# Altium schematic sheet 5V0 Buck Converter.SchDoc: LM27403 5.0V Buck Converter
size Letter; SheetNumber: 5; SheetTotal: 18
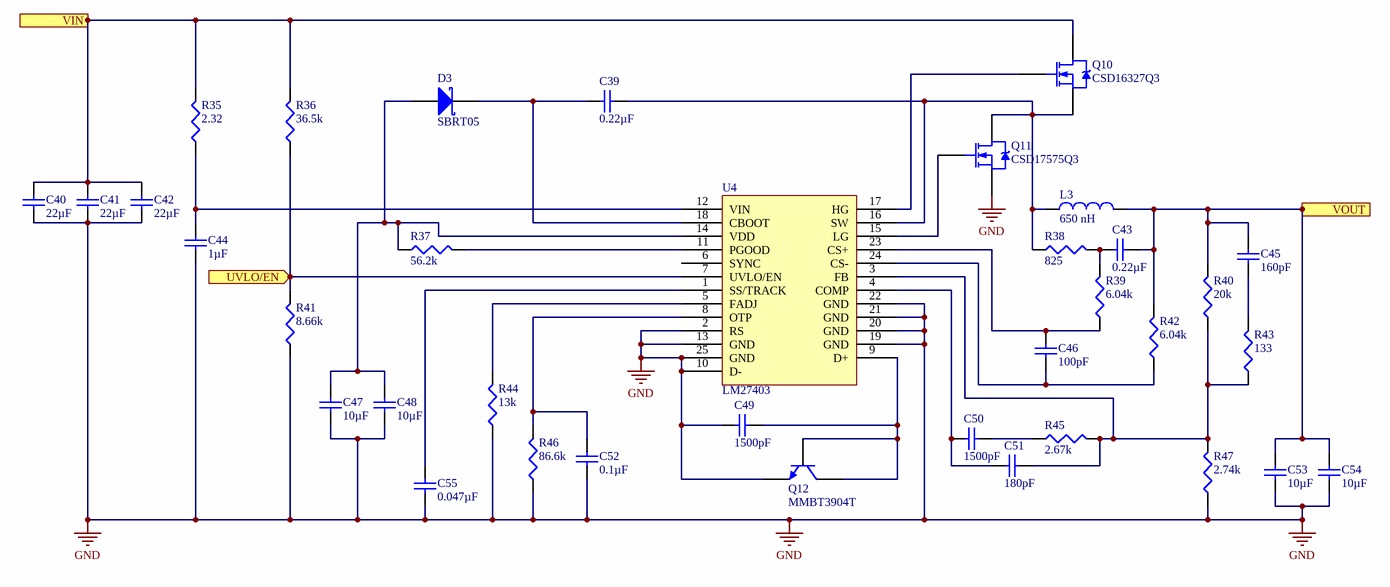
[diagram p0: 5V0 Buck Converter.SchDoc]

## Parts
C39  value 0.22µF  [TY-0402V]  (hidden comment: Cap)
C40  value 22µF  [TY-1210M]  (hidden comment: Cap)
C41  value 22µF  [TY-1210M]  (hidden comment: Cap)
C42  value 22µF  [TY-1210M]  (hidden comment: Cap)
C43  value 0.22µF  [TY-0402V]  (hidden comment: Cap)
C44  value 1µF  [TY-0402V]  (hidden comment: Cap)
C45  value 160pF  [KEM-CBR04]  (hidden comment: Cap)
C46  value 100pF  [TDK-CGA2B]  (hidden comment: Cap)
C47  value 10µF  [TY-0603A]  (hidden comment: Cap)
C48  value 10µF  [TY-0603A]  (hidden comment: Cap)
C49  value 1500pF  [TDK-CGA2B]  (hidden comment: Cap)
C50  value 1500pF  [TDK-CGA2B]  (hidden comment: Cap)
C51  value 180pF  [TDK-CGA2B]  (hidden comment: Cap)
C52  value 0.1µF  [TDK-CGA2B]  (hidden comment: Cap)
C53  value 10µF  [TY-1210M]  (hidden comment: Cap)
C54  value 10µF  [TY-1210M]  (hidden comment: Cap)
C55  value 0.047µF  [TDK-CGA2B]  (hidden comment: Cap)
D3  SBRT05  [DIOD-X2-DFN1006-2]
L3  value 650 nH  [CCI-XAL7070]  (hidden comment: XAL7070-651MEC)
Q10  CSD16327Q3  [TI-Q3]
Q11  CSD17575Q3  [TI-Q3]
Q12  MMBT3904T  [SOT523]
R35  value 2.32  [VSH-0402MCS]  (hidden comment: Res3)
R36  value 36.5k  [PANA-ERA2A]  (hidden comment: Res3)
R37  value 56.2k  [PANA-ERA2A]  (hidden comment: Res3)
R38  value 825  [PANA-ERA2A]  (hidden comment: Res3)
R39  value 6.04k  [PANA-ERA2A]  (hidden comment: Res3)
R40  value 20k  [PANA-ERJ2R]  (hidden comment: Res3)
R41  value 8.66k  [PANA-ERA2A]  (hidden comment: Res3)
R42  value 6.04k  [PANA-ERA2A]  (hidden comment: Res3)
R43  value 133  [PANA-ERJ2R]  (hidden comment: Res3)
R44  value 13k  [PANA-ERA2A]  (hidden comment: Res3)
R45  value 2.67k  [PANA-ERJ2R]  (hidden comment: Res3)
R46  value 86.6k  [PANA-ERA2A]  (hidden comment: Res3)
R47  value 2.74k  [PANA-ERJ2R]  (hidden comment: Res3)
U4  LM27403  [TI-RTW0024A]

## Ports
UVLO/EN (in), VIN (in), VOUT (out)

## Nets
GND: C40.1 C41.1 C42.1 C44.1 C47.1 C48.1 C49.1 C52.1 C53.1 C54.1 C55.1 Q11.3(S) Q12.1(E) R41.1 R44.1 R46.1 R47.1 U4.2(RS) U4.10(D-) U4.13(GND) U4.19(GND) U4.20(GND) U4.21(GND) U4.22(GND) U4.25(GND)
UVLO/EN: R36.1 R41.2 U4.7(UVLO/EN) ; port UVLO/EN
VIN: C40.2 C41.2 C42.2 Q10.2(D) R35.2 R36.2 ; port VIN
VOUT: C43.2 C45.2 C53.2 C54.2 L3.2 R40.2 R42.2 ; port VOUT
NetC39_1: C39.1 D3.2(K) U4.18(CBOOT)
NetC39_2: C39.2 L3.1 Q10.3(S) Q11.2(D) R38.1 U4.16(SW)
NetC43_1: C43.1 R38.2 R39.2
NetC44_2: C44.2 R35.1 U4.12(VIN)
NetC45_1: C45.1 R43.2
NetC46_1: C46.1 R42.1 U4.24(CS-)
NetC46_2: C46.2 R39.1 U4.23(CS+)
NetC47_2: C47.2 C48.2 D3.1(A) R37.1 U4.14(VDD)
NetC49_2: C49.2 Q12.2(B) Q12.3(C) U4.9(D+)
NetC50_1: C50.1 C51.1 U4.4(COMP)
NetC50_2: C50.2 R45.1
NetC51_2: C51.2 R40.1 R43.1 R45.2 R47.2 U4.3(FB)
NetC52_2: C52.2 R46.2 U4.8(OTP)
NetC55_2: C55.2 U4.1(SS/TRACK)
NetQ10_1: Q10.1(G) U4.17(HG)
NetQ11_1: Q11.1(G) U4.15(LG)
NetR37_2: R37.2 U4.11(PGOOD)
NetR44_2: R44.2 U4.5(FADJ)

Not connected (* = marked no-connect by the designer): U4 6(SYNC)

## Notes on the sheet
- (the "License"); you may not use or redistribute this file except in compliance with the License. You
- This file and the information within it are licensed under the terms of the Apache License, Version 2.0
- Copyright
- Unless required by applicable law or agreed to in writing, content distributed under the License is
- distributed on an "AS IS" BASIS, WITHOUT WARRANTIES OR CONDITIONS OF ANY KIND,
- either express or implied. See the License for the specific language governing permissions and
- limitations under the License.
- may obtain a copy of the License at:
- http://www.apache.org/licenses/LICENSE-2.0
- Title
- Size:
- Date:
- Letter
- Number:
- Time:
- Revision:
- Sheet
- of
- University of Alberta
- Deptartment of Electrical
- and Computer Engineering
- Edmonton AB, Canada
- T6G 1H9
- File:

## Library data of the parts
C39 C43 = PC-TY-00301: CAP CER 0.22UF 50V X5R 0402; Manufacturer Part Number: UMK105BJ224KV-F; Index: 301; Designator: C?; Tolerance: ±10%; Published: 2016-03-13; LatestRevisionDate: 2016-03-13; LatestRevisionNote: ...; PackageReference: 0402 (1005 Metric); Publisher: AlbertaSat; PackageDescription: Chip Capacitor, 2-Leads, Body 1.00x0.50mm, IPC Low Density; Part Number: PC-TY-00301; Supplier Part Number 1: 587-3500-1-ND; Supplier 1: Digi-key; Supplier Link: http://www.digikey.ca/product-search/en?keywords=587-3500-1-ND; Voltage-Rated: 50V; Temperature Coefficient: X5R; Application: General Purpose
C40-C42 = PC-TY-00742: CAP CER 22UF 25V X7R 1210; Manufacturer Part Number: TMK325B7226MM-TR; Index: 742; Designator: C?; Tolerance: ±20%; Published: 2016-03-13; LatestRevisionDate: 2016-03-13; LatestRevisionNote: ...; PackageReference: 1210 (3225 Metric); Publisher: AlbertaSat; PackageDescription: Chip Capacitor, 2-Leads, Body 3.20x2.50mm, IPC Low Density; Part Number: PC-TY-00742; Supplier Part Number 1: 587-2784-1-ND; Supplier 1: Digi-key; Supplier Link: http://www.digikey.ca/product-search/en?keywords=587-2784-1-ND; Voltage-Rated: 25V; Temperature Coefficient: X7R; Application: General Purpose
C44 = PC-TY-00381: CAP CER 1UF 25V X5R 0402; Manufacturer Part Number: TMK105BJ105MV-F; Index: 381; Designator: C?; Tolerance: ±20%; Published: 2016-03-13; LatestRevisionDate: 2016-03-13; LatestRevisionNote: ...; PackageReference: 0402 (1005 Metric); Publisher: AlbertaSat; PackageDescription: Chip Capacitor, 2-Leads, Body 1.00x0.50mm, IPC Low Density; Part Number: PC-TY-00381; Supplier Part Number 1: 587-3245-1-ND; Supplier 1: Digi-key; Supplier Link: http://www.digikey.ca/product-search/en?keywords=587-3245-1-ND; Voltage-Rated: 25V; Temperature Coefficient: X5R; Application: General Purpose
C45 = PC-KEM-03162: CAP CER 160PF 50V C0G/NP0 0402; Manufacturer Part Number: C0402C161J5GAC7867; Index: 3162; Designator: C?; Tolerance: ±5%; Temperature Coefficient: C0G, NP0; Published: 2019-08-09; LatestRevisionDate: 2019-08-09; LatestRevisionNote: ...; PackageReference: 0402 (1005 Metric); Publisher: AlbertaSat; PackageDescription: Chip Capacitor, 2-Leads, Body 1.00x0.50mm, IPC Low Density; Part Number: PC-KEM-03162; Supplier Part Number 1: 399-14888-1-ND; Supplier 1: Digi-key; Supplier Part Number 2: 80-C0402C161J5G; Supplier 2: Mouser; Supplier Link: #https://www.digikey.ca/products/en?keywords=399-14888-1-ND#; Voltage - Rated: 50V; Applications: General Purpose
C46 = PC-TDK-01227: CAP CER 100PF 50V C0G 0402; Manufacturer Part Number: CGA2B2C0G1H101J050BA; Index: 1227; Designator: C?; Tolerance: ±5%; Temperature Coefficient: NP0; Published: 2016-03-16; LatestRevisionDate: 2016-03-16; LatestRevisionNote: ...; PackageReference: 0402 (1005 Metric); Publisher: AlbertaSat; PackageDescription: Radial Cap, Thru-Hole; 2 Leads; 0.3 in Pin Spacing; Part Number: PC-TDK-01227; Supplier Part Number 1: 445-5596-1-ND; Supplier 1: Digi-key; Supplier Link: http://www.digikey.ca/product-search/en?keywords=445-5596-1-ND; Voltage - Rated: 50V; Applications: Automotive
C47 C48 = PC-TY-00593: CAP CER 10UF 16V X5R 0603; Manufacturer Part Number: EMK107BBJ106MA-T; Index: 593; Designator: C?; Tolerance: ±20%; Published: 2016-03-13; LatestRevisionDate: 2016-03-13; LatestRevisionNote: ...; PackageReference: 0603 (1608 Metric); Publisher: AlbertaSat; PackageDescription: Chip Capacitor, 2-Leads, Body 1.60x0.80mm, IPC Low Density; Part Number: PC-TY-00593; Supplier Part Number 1: 587-3238-1-ND; Supplier 1: Digi-key; Supplier Link: http://www.digikey.ca/product-search/en?keywords=587-3238-1-ND; Voltage-Rated: 16V; Temperature Coefficient: X5R; Application: General Purpose
C49 C50 = PC-TDK-01528: CAP CER 1500PF 50V X8R 0402; Manufacturer Part Number: CGA2B2X8R1H152K050BA; Index: 1528; Designator: C?; Tolerance: ±10%; Published: 2016-03-16; LatestRevisionDate: 2016-03-16; LatestRevisionNote: ...; PackageReference: 0402 (1005 Metric); Publisher: AlbertaSat; PackageDescription: Radial Cap, Thru-Hole; 2 Leads; 0.3 in Pin Spacing; Part Number: PC-TDK-01528; Supplier Part Number 1: 445-5880-1-ND; Supplier 1: Digi-key; Supplier Link: http://www.digikey.ca/product-search/en?keywords=445-5880-1-ND; Voltage - Rated: 50V; Temperature Coefficient: X8R; Applications: Automotive
C51 = PC-TDK-01279: CAP CER 180PF 50V NP0 0402; Manufacturer Part Number: CGA2B2NP01H181J050BA; Index: 1279; Designator: C?; Tolerance: ±5%; Published: 2016-03-16; LatestRevisionDate: 2016-03-16; LatestRevisionNote: ...; PackageReference: 0402 (1005 Metric); Publisher: AlbertaSat; PackageDescription: Radial Cap, Thru-Hole; 2 Leads; 0.3 in Pin Spacing; Part Number: PC-TDK-01279; Supplier Part Number 1: 445-12125-1-ND; Supplier 1: Digi-key; Supplier Link: http://www.digikey.ca/product-search/en?keywords=445-12125-1-ND; Voltage - Rated: 50V; Temperature Coefficient: NP0; Applications: Automotive
C52 = PC-TDK-02246: CAP CER 0.1UF 10V X5R 0402; Manufacturer Part Number: CGA2B2X5R1A104K050BA; Index: 2246; Designator: C?; Tolerance: ±10%; Published: 2016-03-16; LatestRevisionDate: 2016-03-16; LatestRevisionNote: ...; PackageReference: 0402 (1005 Metric); Publisher: AlbertaSat; PackageDescription: Radial Cap, Thru-Hole; 2 Leads; 0.3 in Pin Spacing; Part Number: PC-TDK-02246; Supplier Part Number 1: 445-12156-1-ND; Supplier 1: Digi-key; Supplier Link: http://www.digikey.ca/product-search/en?keywords=445-12156-1-ND; Voltage - Rated: 10V; Temperature Coefficient: X5R; Applications: Automotive
C53 C54 = PC-TY-00679: CAP CER 10UF 50V X7R 1210; Manufacturer Part Number: UMK325AB7106KM-T; Index: 679; Designator: C?; Tolerance: ±10%; Published: 2016-03-13; LatestRevisionDate: 2016-03-13; LatestRevisionNote: ...; PackageReference: 1210 (3225 Metric); Publisher: AlbertaSat; PackageDescription: Chip Capacitor, 2-Leads, Body 3.20x2.50mm, IPC Low Density; Part Number: PC-TY-00679; Supplier Part Number 1: 587-3167-1-ND; Supplier 1: Digi-key; Supplier Link: http://www.digikey.ca/product-search/en?keywords=587-3167-1-ND; Voltage-Rated: 50V; Temperature Coefficient: X7R; Application: General Purpose
C55 = PC-TDK-02123: CAP CER 0.047UF 25V X7R 0402; Manufacturer Part Number: CGA2B1X7R1E473K050BC; Index: 2123; Designator: C?; Tolerance: ±10%; Published: 2016-03-16; LatestRevisionDate: 2016-03-16; LatestRevisionNote: ...; PackageReference: 0402 (1005 Metric); Publisher: AlbertaSat; PackageDescription: Radial Cap, Thru-Hole; 2 Leads; 0.3 in Pin Spacing; Part Number: PC-TDK-02123; Supplier Part Number 1: 445-5610-1-ND; Supplier 1: Digi-key; Supplier Link: http://www.digikey.ca/product-search/en?keywords=445-5610-1-ND; Voltage - Rated: 25V; Temperature Coefficient: X7R; Applications: Automotive
D3 = 29: SUPER BARRIER RECTIFIER X2-DFN10; Part Number: 29; Manufacturer Part Number: SBRT05U20LPS-7B; Designator: D?; Voltage - Forward (Max): 390mV @ 500mA; Published: 8-Jun-2000; LatestRevisionDate: 17-Jul-2002; LatestRevisionNote: Re-released for DXP Platform.; PackageReference: DFN 0402 (1006 Metric); Publisher: Altium Limited; PackageDescription: DO-214-AA/SMB; 2 C-Bend Leads; Body 5.3 x 3.6 mm, inc. leads (LxW); Code_JEDEC: DO-214-AA; Supplier Part Number 1: SBRT05U20LPS-7BDICT-ND; Supplier 1: Digi-Key; Supplier Part Number 2: 621-SBRT05U20LPS-7B; Supplier 2: Mouser; Supplier Link: #https://www.digikey.ca/products/en?keywords=SBRT05U20LPS-7BDICT-ND#
L3 = PL-CCI-00013: Fixed Inductors 0.65uH 20% 26.5A 1.93mOhms AEC-Q200; Code_IEC: 1005; Index: 13; Designator: L?; Published: 2019-08-06; LatestRevisionDate: 2019-08-06; LatestRevisionNote: ...; PackageReference: CCI-XAL7070; Publisher: AlbertaSat; PackageDescription: Precision Wire Wound Inductor, 2-Leads, Body 7.20x7.50mm, IPC Low Density; Code_JEITA: 0402; Part Number: PL-CCI-00013; Manufacturer Part Number: XAL7070-651MEC; Supplier Part Number 1: 994-XAL7070-651MEC; Supplier 1: Mouser; Supplier Part Number 2: XAL7070-651MEC; Supplier 2: Coilcraft Direct; Supplier Link: #https://www.mouser.ca/ProductDetail/Coilcraft/XAL7070-651MEC?qs=%2Fha2pyFaduhG5%252Ba4CuVa5jFvImje735VGlWzHt6zjMOzK5HnICZz8T3bLeKmdOa2#
Q10 = 62: MOSFET N-CH 25V 60A 8SON; Part Number: 62; Note: Pin 2 is electrically connected to pin 4.; Designator: Q?; Published: 8-Jun-2000; LatestRevisionDate: 17-Jul-2002; LatestRevisionNote: Re-released for DXP Platform.; DatasheetVersion: PD-9.814; PackageVersion: Feb-1997; PackageReference: 8-VSON-CLIP (3.3x3.3); Publisher: Altium Limited; PackageDescription: TO, Thru-Hole, Vertical, Heatsink Mounted; 3 In-Line Leads; Pitch 2.54 mm; ComponentLink1Description: Manufacturer Link; ComponentLink1URL: http://www.irf.com/; Supplier Part Number 2: 595-CSD16327Q3; Supplier 2: Mouser; Manufacturer Part Number: CSD16327Q3; Supplier Part Number 1: 296-30138-1-ND; Supplier 1: Digi-Key; Supplier Link: #https://www.digikey.ca/product-detail/en/texas-instruments/CSD16327Q3/296-30138-1-ND/2811417#; Operating Temperature: -55°C ~ 150°C (TJ)
Q11 = 63: N-Channel 30V 60A (Ta) 2.8W (Ta), 108W (Tc) Surface Mount 8-VSON-CLIP (3.3x3.3); Part Number: 63; Note: Pin 2 is electrically connected to pin 4.; Designator: Q?; Published: 8-Jun-2000; LatestRevisionDate: 17-Jul-2002; LatestRevisionNote: Re-released for DXP Platform.; DatasheetVersion: PD-9.814; PackageVersion: Feb-1997; PackageReference: 8-VSON-CLIP (3.3x3.3); Publisher: Altium Limited; PackageDescription: TO, Thru-Hole, Vertical, Heatsink Mounted; 3 In-Line Leads; Pitch 2.54 mm; ComponentLink1Description: Manufacturer Link; ComponentLink1URL: http://www.irf.com/; Supplier Part Number 2: 595-CSD17575Q3; Supplier 2: Mouser; Manufacturer Part Number: CSD17575Q3; Supplier Part Number 1: 296-39994-1-ND; Supplier 1: Digi-Key; Supplier Link: #https://www.digikey.ca/product-detail/en/texas-instruments/CSD17575Q3/296-39994-1-ND/5177871#; Operating Temperature: -55°C ~ 150°C (TJ)
Q12 = 34: Bipolar (BJT) Transistor NPN 40V 200mA 300MHz 150mW Surface Mount SOT-523; Part Number: 34; Manufacturer Part Number: MMBT3904T-7-F; Designator: Q?; Published: 8-Jun-2000; LatestRevisionDate: 15-Jan-2003; LatestRevisionNote: PCB Footprint 'BCY-W3/D4.7' replaced; DatasheetVersion: 1997; PackageVersion: Sep-1998; PackageReference: SOT523; Publisher: Altium Limited; PackageDescription: TO, Flat Index; 3 In-Line, Axial Leads; Body Dia. 4.5mm; Leads 0.51 x 0.48 mm (max); ComponentLink1Description: Manufacturer Link; ComponentLink1URL: http://www.fairchildsemi.com/; ComponentLink2Description: Datasheet; ComponentLink2URL: http://www.fairchildsemi.com/ds/2N%2F2N3904.pdf; Supplier Part Number 1: MMBT3904T-FDICT-ND; Supplier 1: Digi-Key; Supplier Link: #https://www.digikey.ca/product-detail/en/diodes-incorporated/MMBT3904T-7-F/MMBT3904T-FDICT-ND/725060#
R35 = PR-VSH-00271: RES SMD 2.32 OHM 1% 1/16W 0402; Manufacturer Part Number: CRCW04022R32FKED; Index: 271; Designator: R?; Temperature Coefficient: ±100ppm/°C; Published: 2019-05-31; LatestRevisionDate: 2019-05-31; LatestRevisionNote: ...; PackageReference: 0402 (1005 Metric); Publisher: AlbertaSat; PackageDescription: Chip Resistor, 2-Leads, Body 1.00x0.50mm, IPC Low Density; Part Number: PR-VSH-00271; Supplier Part Number 1: 541-2.32LLCT-ND; Supplier 1: Digi-key; Supplier Part Number 2: 71-CRCW04022R32FKED; Supplier 2: Mouser; Supplier Link: #https://www.digikey.ca/products/en/resistors/chip-resistor-surface-mount/52?k=CRCW04022R32FKED&k=&pkeyword=CRCW04022R32FKED&sv=0&pv7=2&sf=0&quantity=&ColumnSort=0&page=1&stock=1&pageSize=25#; Tolerance: ±1%; Power - Rated: 1/16W; Applications: Automotive
R36 = 18127: RES SMD 36.5KOHM 0.1% 1/16W 0402; Part Number: 18127; Manufacturer Part Number: ERA-2AEB3652X; Designator: R?; Power: 0.063W, 1/16W; Temperature Coefficient: ±25ppm/°C; Published: 8-Jun-2000; LatestRevisionDate: 29-May-2009; LatestRevisionNote: IPC-7351 Footprint Added.; PackageReference: 0402 (1005 Metric); Publisher: Altium Limited; PackageDescription: Chip Resistor, 2-Leads, Body 1.00x0.50mm, IPC Low Density; Supplier Part Number 1: P36.5KDCCT-ND; Supplier 1: Digi-Key; Supplier Link: http://www.digikey.ca/product-search/en?keywords=P36.5KDCCT-ND; Tolerance: ±0.1%
R37 = 18410: RES SMD 56.2KOHM 0.1% 1/16W 0402; Part Number: 18410; Manufacturer Part Number: ERA-2AEB5622X; Designator: R?; Power: 0.063W, 1/16W; Temperature Coefficient: ±25ppm/°C; Published: 8-Jun-2000; LatestRevisionDate: 29-May-2009; LatestRevisionNote: IPC-7351 Footprint Added.; PackageReference: 0402 (1005 Metric); Publisher: Altium Limited; PackageDescription: Chip Resistor, 2-Leads, Body 1.00x0.50mm, IPC Low Density; Supplier Part Number 1: P56.2KDCCT-ND; Supplier 1: Digi-Key; Supplier Link: http://www.digikey.ca/product-search/en?keywords=P56.2KDCCT-ND; Tolerance: ±0.1%
R38 = 15284: RES SMD 825 OHM 0.1% 1/16W 0402; Part Number: 15284; Manufacturer Part Number: ERA-2AEB8250X; Designator: R?; Power: 0.063W, 1/16W; Temperature Coefficient: ±25ppm/°C; Published: 8-Jun-2000; LatestRevisionDate: 29-May-2009; LatestRevisionNote: IPC-7351 Footprint Added.; PackageReference: 0402 (1005 Metric); Publisher: Altium Limited; PackageDescription: Chip Resistor, 2-Leads, Body 1.00x0.50mm, IPC Low Density; Supplier Part Number 1: P825DCCT-ND; Supplier 1: Digi-Key; Supplier Link: http://www.digikey.ca/product-search/en?keywords=P825DCCT-ND; Tolerance: ±0.1%
R39 R42 = 16832: RES SMD 6.04KOHM 0.1% 1/16W 0402; Part Number: 16832; Manufacturer Part Number: ERA-2AEB6041X; Designator: R?; Power: 0.063W, 1/16W; Temperature Coefficient: ±25ppm/°C; Published: 8-Jun-2000; LatestRevisionDate: 29-May-2009; LatestRevisionNote: IPC-7351 Footprint Added.; PackageReference: 0402 (1005 Metric); Publisher: Altium Limited; PackageDescription: Chip Resistor, 2-Leads, Body 1.00x0.50mm, IPC Low Density; Supplier Part Number 1: P6.04KDCCT-ND; Supplier 1: Digi-Key; Supplier Link: http://www.digikey.ca/product-search/en?keywords=P6.04KDCCT-ND; Tolerance: ±0.1%
R40 = 17706: RES SMD 20K OHM 1% 1/10W 0402; Part Number: 17706; Manufacturer Part Number: ERJ-2RKF2002X; Designator: R?; Power: 0.1W, 1/10W; Temperature Coefficient: ±100ppm/°C; Published: 8-Jun-2000; LatestRevisionDate: 29-May-2009; LatestRevisionNote: IPC-7351 Footprint Added.; PackageReference: 0402 (1005 Metric); Publisher: Altium Limited; PackageDescription: Chip Resistor, 2-Leads, Body 1.00x0.50mm, IPC Low Density; Supplier Part Number 1: P20.0KLCT-ND; Supplier 1: Digi-Key; Supplier Link: http://www.digikey.ca/product-search/en?keywords=P20.0KLCT-ND; Tolerance: ±1%
R41 = 17100: RES SMD 8.66KOHM 0.1% 1/16W 0402; Part Number: 17100; Manufacturer Part Number: ERA-2AEB8661X; Designator: R?; Power: 0.063W, 1/16W; Temperature Coefficient: ±25ppm/°C; Published: 8-Jun-2000; LatestRevisionDate: 29-May-2009; LatestRevisionNote: IPC-7351 Footprint Added.; PackageReference: 0402 (1005 Metric); Publisher: Altium Limited; PackageDescription: Chip Resistor, 2-Leads, Body 1.00x0.50mm, IPC Low Density; Supplier Part Number 1: P8.66KDCCT-ND; Supplier 1: Digi-Key; Supplier Link: http://www.digikey.ca/product-search/en?keywords=P8.66KDCCT-ND; Tolerance: ±0.1%
R43 = 14215: RES SMD 133 OHM 1% 1/10W 0402; Part Number: 14215; Manufacturer Part Number: ERJ-2RKF1330X; Designator: R?; Power: 0.1W, 1/10W; Temperature Coefficient: ±100ppm/°C; Published: 8-Jun-2000; LatestRevisionDate: 29-May-2009; LatestRevisionNote: IPC-7351 Footprint Added.; PackageReference: 0402 (1005 Metric); Publisher: Altium Limited; PackageDescription: Chip Resistor, 2-Leads, Body 1.00x0.50mm, IPC Low Density; Supplier Part Number 1: P133LCT-ND; Supplier 1: Digi-Key; Supplier Link: http://www.digikey.ca/product-search/en?keywords=P133LCT-ND; Tolerance: ±1%
R44 = 17372: RES SMD 13K OHM 0.1% 1/16W 0402; Part Number: 17372; Manufacturer Part Number: ERA-2AEB133X; Designator: R?; Power: 0.063W, 1/16W; Temperature Coefficient: ±25ppm/°C; Published: 8-Jun-2000; LatestRevisionDate: 29-May-2009; LatestRevisionNote: IPC-7351 Footprint Added.; PackageReference: 0402 (1005 Metric); Publisher: Altium Limited; PackageDescription: Chip Resistor, 2-Leads, Body 1.00x0.50mm, IPC Low Density; Supplier Part Number 1: P13KDCCT-ND; Supplier 1: Digi-Key; Supplier Link: http://www.digikey.ca/product-search/en?keywords=P13KDCCT-ND; Tolerance: ±0.1%
R45 = 16187: RES SMD 2.67K OHM 1% 1/10W 0402; Part Number: 16187; Manufacturer Part Number: ERJ-2RKF2671X; Designator: R?; Power: 0.1W, 1/10W; Temperature Coefficient: ±100ppm/°C; Published: 8-Jun-2000; LatestRevisionDate: 29-May-2009; LatestRevisionNote: IPC-7351 Footprint Added.; PackageReference: 0402 (1005 Metric); Publisher: Altium Limited; PackageDescription: Chip Resistor, 2-Leads, Body 1.00x0.50mm, IPC Low Density; Supplier Part Number 1: P2.67KLCT-ND; Supplier 1: Digi-Key; Supplier Link: http://www.digikey.ca/product-search/en?keywords=P2.67KLCT-ND; Tolerance: ±1%
R46 = 18660: RES SMD 86.6KOHM 0.1% 1/16W 0402; Part Number: 18660; Manufacturer Part Number: ERA-2AEB8662X; Designator: R?; Power: 0.063W, 1/16W; Temperature Coefficient: ±25ppm/°C; Published: 8-Jun-2000; LatestRevisionDate: 29-May-2009; LatestRevisionNote: IPC-7351 Footprint Added.; PackageReference: 0402 (1005 Metric); Publisher: Altium Limited; PackageDescription: Chip Resistor, 2-Leads, Body 1.00x0.50mm, IPC Low Density; Supplier Part Number 1: P86.6KDCCT-ND; Supplier 1: Digi-Key; Supplier Link: http://www.digikey.ca/product-search/en?keywords=P86.6KDCCT-ND; Tolerance: ±0.1%
R47 = 16224: RES SMD 2.74K OHM 1% 1/10W 0402; Part Number: 16224; Manufacturer Part Number: ERJ-2RKF2741X; Designator: R?; Power: 0.1W, 1/10W; Temperature Coefficient: ±100ppm/°C; Published: 8-Jun-2000; LatestRevisionDate: 29-May-2009; LatestRevisionNote: IPC-7351 Footprint Added.; PackageReference: 0402 (1005 Metric); Publisher: Altium Limited; PackageDescription: Chip Resistor, 2-Leads, Body 1.00x0.50mm, IPC Low Density; Supplier Part Number 1: P2.74KLCT-ND; Supplier 1: Digi-Key; Supplier Link: http://www.digikey.ca/product-search/en?keywords=P2.74KLCT-ND; Tolerance: ±1%
U4 = 61: Buck Regulator Positive Output Step-Down  DC-DC Controller IC 24-WQFN (4x4); Part Number: 61; Supplier Part Number 2: 595-LM27403SQ/NOPB; Supplier 2: Mouser; Manufacturer Part Number: LM27403SQ/NOPB; Supplier Part Number 1: 296-37015-1-ND; Supplier 1: Digi-Key; Supplier Link: https://www.digikey.ca/product-detail/en/texas-instruments/LM27403SQ-NOPB/296-37015-1-ND/4430488; PackageReference: 24-WFQFN Exposed Pad; Operating Temperature: -40°C ~ 125°C (TJ)